# Altium project MecanumCar.PrjPcb
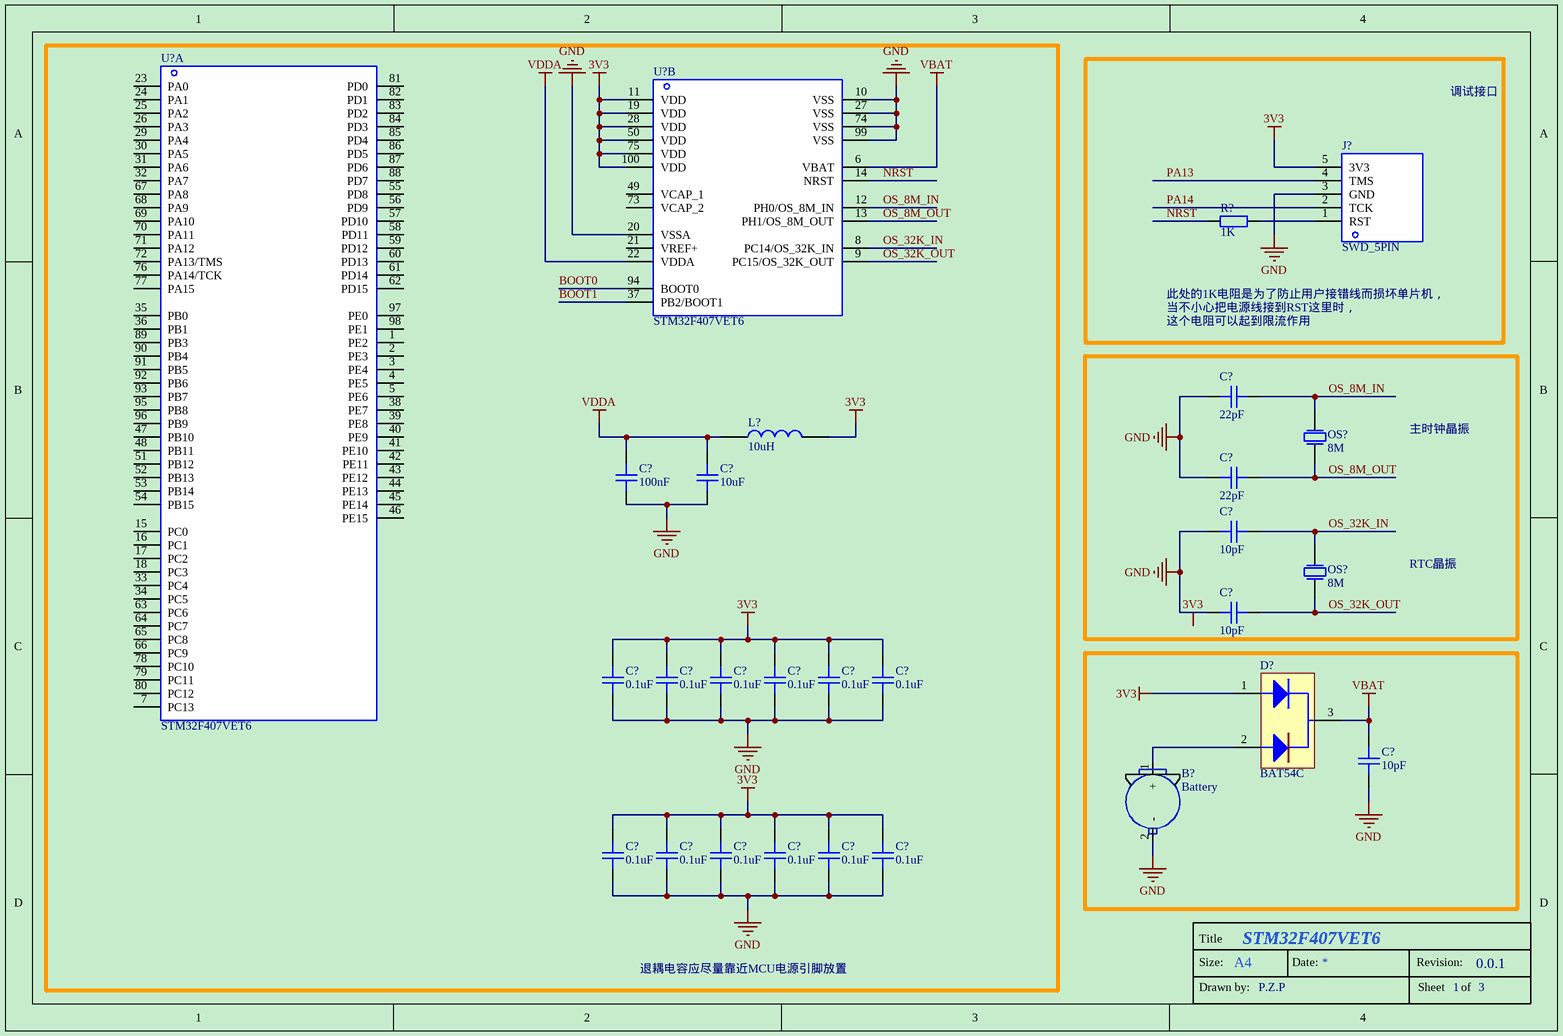
[diagram p0: STM32F407VET6.SchDoc]
2 sheets, 38 parts. Net scope: global (net labels, ports and power ports of the same name join across sheets).
Sheets:
  STM32F407VET6.SchDoc
  Power Supply.SchDoc

## Sheet STM32F407VET6.SchDoc: STM32F407VET6
size A4; DrawnBy: P.Z.P; Revision: 0.0.1; SheetNumber: 1; SheetTotal: 3

### Parts
(Parts that share a designator on the sheet are numbered #1, #2 ... from top to bottom, then left to right.)
B?  Battery  [Battery]
C?#1  22pF  [0603L]
C?#2  100nF  [0603L]
C?#3  10uF  [0603L]
C?#4  22pF  [0603L]
C?#5  10pF  [0603L]
C?#6  10pF  [0603L]
C?#7  0.1uF  [0603L]
C?#8  0.1uF  [0603L]
C?#9  0.1uF  [0603L]
C?#10  0.1uF  [0603L]
C?#11  0.1uF  [0603L]
C?#12  0.1uF  [0603L]
C?#13  10pF  [0603L]
C?#14  0.1uF  [0603L]
C?#15  0.1uF  [0603L]
C?#16  0.1uF  [0603L]
C?#17  0.1uF  [0603L]
C?#18  0.1uF  [0603L]
C?#19  0.1uF  [0603L]
D?#1  BAT54C
J?#1  SWD_5PIN  [Debug-SWD]
L?  10uH  [0603L]
OS?#1  8M  [XTAL4]
OS?#2  8M  [XTAL4]
R?  1K  [0603L]
U?#1  STM32F407VET6  (part B of 2)
U?#2  STM32F407VET6  (part A of 2)

### Blocks framed on the sheet
退耦电容应尽量靠近MCU电源引脚放置: C?#2 C?#3 C?#7-C?#12 C?#14-C?#19 L? U?#1 U?#2

### Nets
3V3: C?#7.1 C?#8.1 C?#9.1 C?#10.1 C?#11.1 C?#12.1 C?#14.1 C?#15.1 C?#16.1 C?#17.1 C?#18.1 C?#19.1 D?#1.1 J?#1.5(3V3) L?.2 U?#1.11(VDD) U?#1.19(VDD) U?#1.28(VDD) U?#1.50(VDD) U?#1.75(VDD) U?#1.100(VDD)
GND: B?.2(-) C?#1.2 C?#2.2 C?#3.2 C?#4.2 C?#5.2 C?#6.2 C?#7.2 C?#8.2 C?#9.2 C?#10.2 C?#11.2 C?#12.2 C?#13.2 C?#14.2 C?#15.2 C?#16.2 C?#17.2 C?#18.2 C?#19.2 J?#1.3(GND) U?#1.10(VSS) U?#1.20(VSSA) U?#1.27(VSS) U?#1.74(VSS) U?#1.99(VSS)
VBAT: C?#13.1 D?#1.3 U?#1.6(VBAT)
VDDA: C?#2.1 C?#3.1 L?.1 U?#1.22(VDDA)
BOOT0: U?#1.94(BOOT0)
BOOT1: U?#1.37(PB2/BOOT1)
NRST: R?.1 U?#1.14(NRST)
OS_8M_IN: C?#1.1 OS?#1.2(P2) U?#1.12(PH0/OS_8M_IN)
OS_8M_OUT: C?#4.1 OS?#1.1(P1) U?#1.13(PH1/OS_8M_OUT)
OS_32K_IN: C?#5.1 OS?#2.2(P2) U?#1.8(PC14/OS_32K_IN)
OS_32K_OUT: C?#6.1 OS?#2.1(P1) U?#1.9(PC15/OS_32K_OUT)
PA13: J?#1.4(TMS)
PA14: J?#1.2(TCK)
NetB?_1: B?.1(+) D?#1.2
NetJ?#1_1: J?#1.1(RST) R?.2

Not connected (* = marked no-connect by the designer): U?#1 21(VREF+) 49(VCAP_1) 73(VCAP_2); U?#2 1(PE2) 2(PE3) 3(PE4) 4(PE5) 5(PE6) 7(PC13) 15(PC0) 16(PC1) 17(PC2) 18(PC3) 23(PA0) 24(PA1) 25(PA2) 26(PA3) 29(PA4) 30(PA5) 31(PA6) 32(PA7) 33(PC4) 34(PC5) 35(PB0) 36(PB1) 38(PE7) 39(PE8) 40(PE9) 41(PE10) 42(PE11) 43(PE12) 44(PE13) 45(PE14) 46(PE15) 47(PB10) 48(PB11) 51(PB12) 52(PB13) 53(PB14) 54(PB15) 55(PD8) 56(PD9) 57(PD10) 58(PD11) 59(PD12) 60(PD13) 61(PD14) 62(PD15) 63(PC6) 64(PC7) 65(PC8) 66(PC9) 67(PA8) 68(PA9) 69(PA10) 70(PA11) 71(PA12) 72(PA13/TMS) 76(PA14/TCK) 77(PA15) 78(PC10) 79(PC11) 80(PC12) 81(PD0) 82(PD1) 83(PD2) 84(PD3) 85(PD4) 86(PD5) 87(PD6) 88(PD7) 89(PB3) 90(PB4) 91(PB5) 92(PB6) 93(PB7) 95(PB8) 96(PB9) 97(PE0) 98(PE1)

### Notes on the sheet
- 调试接口
- 此处的1K电阻是为了防止用户接错线而损坏单片机，
- 当不小心把电源线接到RST这里时，
- 这个电阻可以起到限流作用
- 主时钟晶振
- RTC晶振
- Labels drawn without touching a wire or pin: 3V3
- Title
- Size:
- Drawn by:
- A4
- Date:
- Revision:
- Sheet
- of

### Library data of the parts
B? = Battery: 纽扣电池
C?#1-C?#19 = Cap1: 无级电容
  C?#1 C?#4: value: 22pF
  C?#2: value: 100nF
  C?#3: value: 10uF
  C?#5 C?#6 C?#13: value: 10pF
  C?#7-C?#12 C?#14-C?#19: value: 0.1uF
J?#1 = Debug-SWD: 调试接口
L? = Inductor1: 无芯电感; value: 10uH
OS?#1 OS?#2 = XTAL1: 无源晶振; vaule: 8M
R? = Res: 电阻; value: 1K
U?#1 U?#2 = STM32F407VET6_B

## Sheet Power Supply.SchDoc: Power Supply
size A4; DrawnBy: P.Z.P; Revision: 0.0.1; SheetNumber: 2; SheetTotal: 3
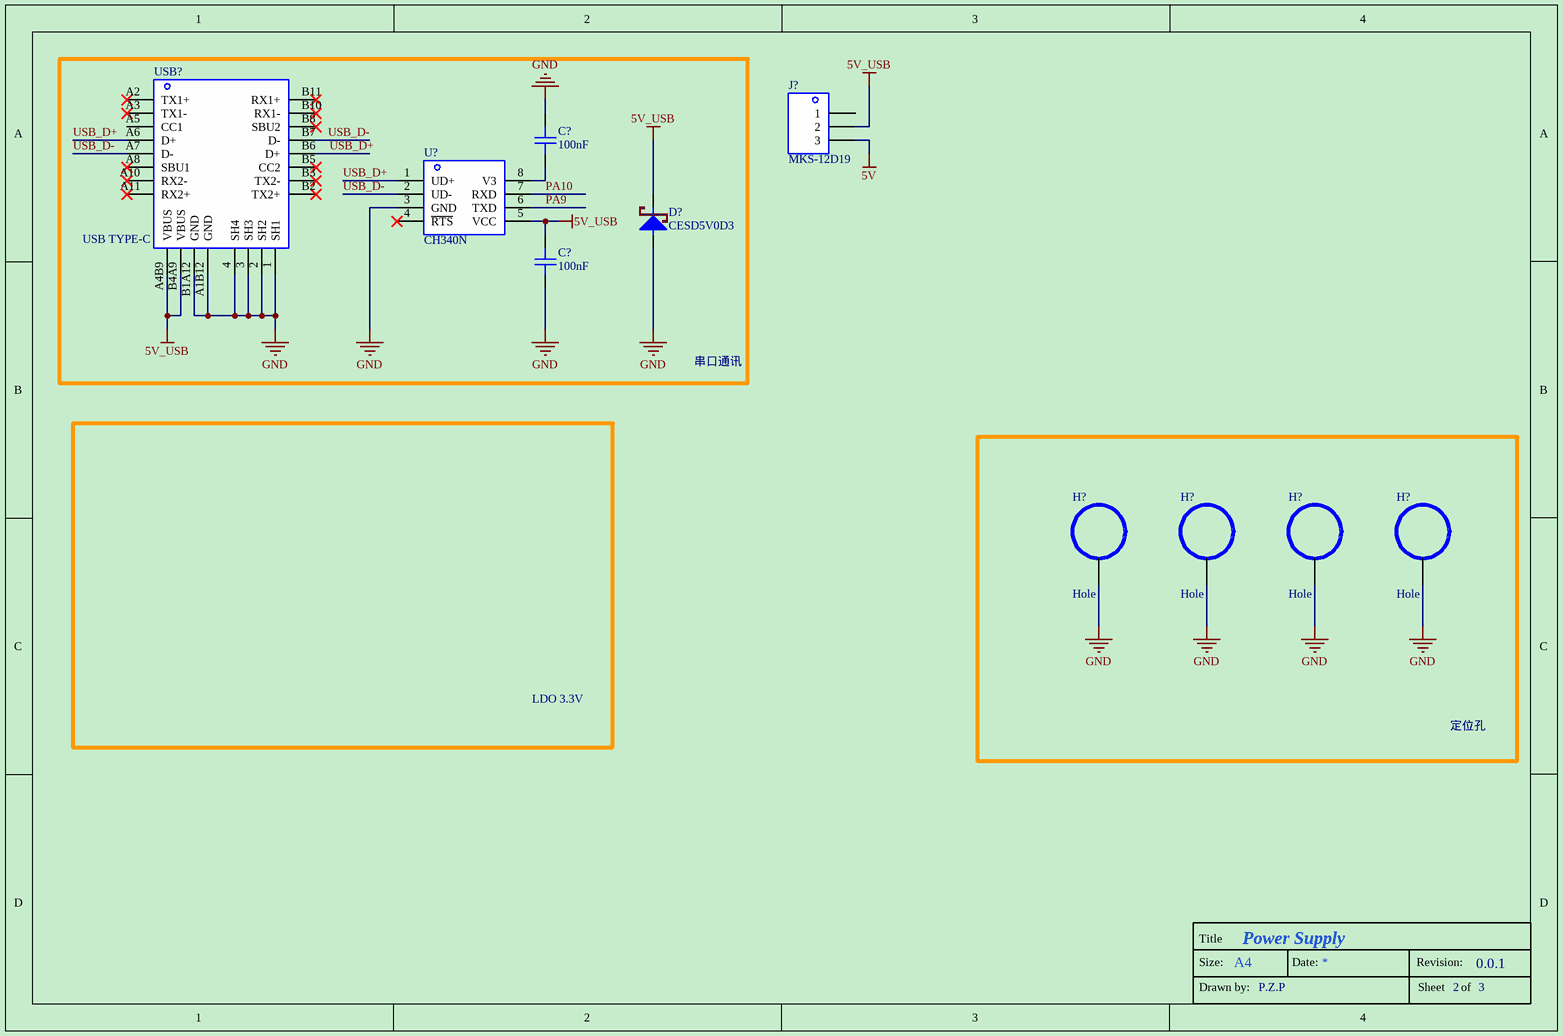
[diagram p1: Power Supply.SchDoc]

### Parts
(Parts that share a designator on the sheet are numbered #1, #2 ... from top to bottom, then left to right.)
C?#20  100nF  [0603L]
C?#21  100nF  [0603L]
D?#2  CESD5V0D3  [0603L]
H?#1  Hole  [Hole]
H?#2  Hole  [Hole]
H?#3  Hole  [Hole]
H?#4  Hole  [Hole]
J?#2  MKS-12D19  [MSK-12D19]
U?#3  CH340N
USB?  USB TYPE-C

### Blocks framed on the sheet
串口通讯: C?#20 C?#21 D?#2 U?#3 USB?
定位孔: H?#1-H?#4

### Nets
5V: J?#2.3
5V_USB: C?#21.1 D?#2.2(K) J?#2.2 U?#3.5(VCC) USB?.A4B9(VBUS) USB?.B4A9(VBUS)
GND: C?#20.2 C?#21.2 D?#2.1(A) H?#1.1 H?#2.1 H?#3.1 H?#4.1 U?#3.3(GND) USB?.1(SH1) USB?.2(SH2) USB?.3(SH3) USB?.4(SH4) USB?.A1B12(GND) USB?.B1A12(GND)
PA9: U?#3.6(TXD)
PA10: U?#3.7(RXD)
USB_D+: U?#3.1(UD+) USB?.A6(D+) USB?.B6(D+)
USB_D-: U?#3.2(UD-) USB?.A7(D-) USB?.B7(D-)
NetC?#20_1: C?#20.1 U?#3.8(V3)

Not connected (* = marked no-connect by the designer): J?#2 1; U?#3 4(~{RTS})*; USB? A2(TX1+)* A3(TX1-)* A5(CC1) A8(SBU1)* A10(RX2-)* A11(RX2+)* B2(TX2+)* B3(TX2-)* B5(CC2)* B8(SBU2)* B10(RX1-)* B11(RX1+)*

### Notes on the sheet
- LDO 3.3V
- Title
- Size:
- Drawn by:
- A4
- Date:
- Revision:
- Sheet
- of

### Library data of the parts
C?#20 C?#21 = Cap1: 无级电容; value: 100nF
D?#2 = TVS: 瞬态二极管
H?#1-H?#4 = Hole: 定位孔
J?#2 = SW1: 拨动开关

## Nets that join several sheets
GND: STM32F407VET6 (26 pins), Power Supply (14 pins)